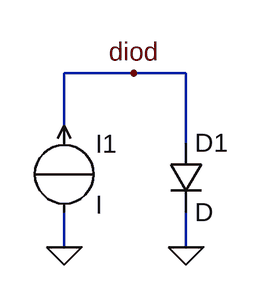
[diagram p0: schematic diode_1.asc]
diode_1.asc, the LTspice schematic file:
Version 4
SHEET 1 880 680
WIRE 176 80 112 80
WIRE 224 80 176 80
WIRE 112 128 112 80
WIRE 224 144 224 80
WIRE 112 240 112 208
WIRE 224 240 224 208
FLAG 112 240 0
FLAG 224 240 0
FLAG 176 80 diod
SYMBOL diode 208 144 R0
SYMATTR InstName D1
SYMBOL source-I 112 128 R0
SYMATTR InstName I1

The netlist it stands for:
* diode_1.asc
D1 diod 0 D
I1 0 diod I
.model D D
.lib standard.dio
.backanno
.end